# EAGLE design smd (EAGLE 6.4)
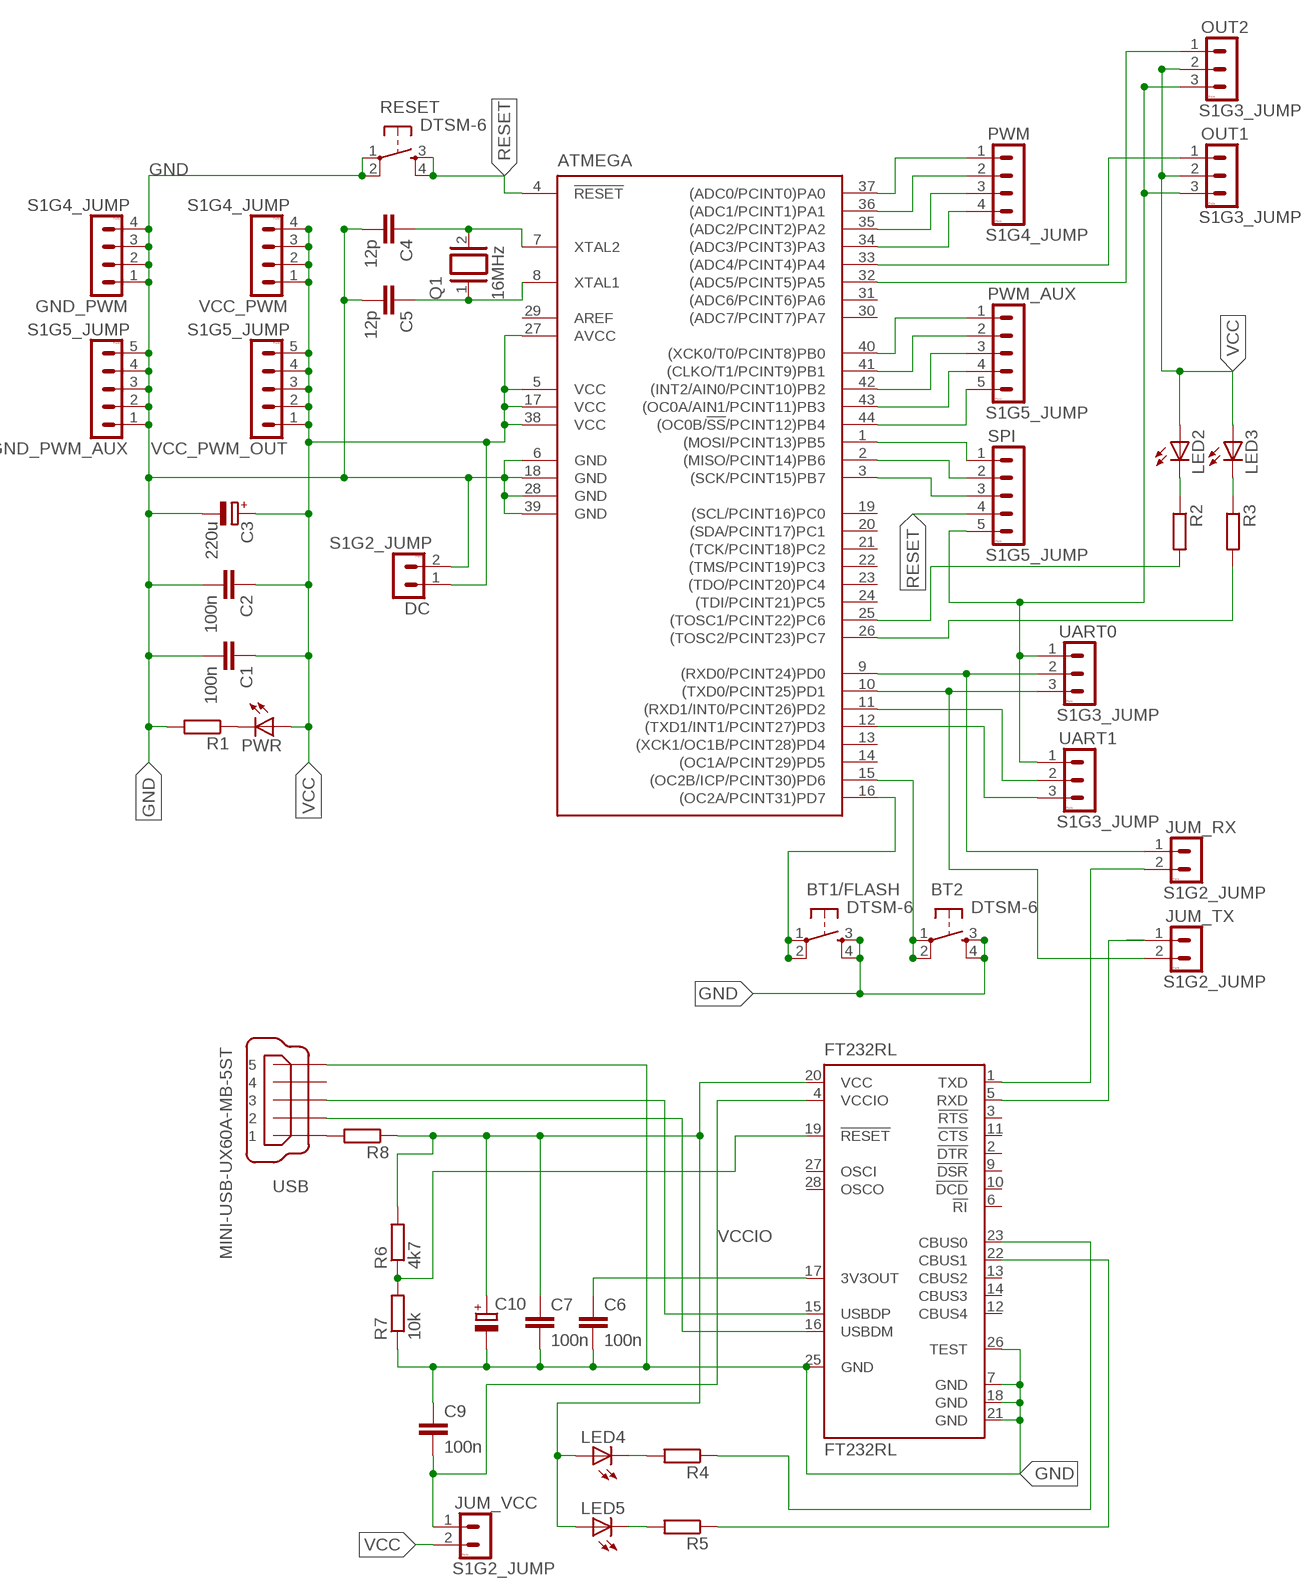
[diagram p0: schematic, sheet 1]

## Parts
ATMEGA  MEGA164P/324P/644P-AU  [TQFP44]
BT1/FLASH  DTSM-6  [DTSM-6]
BT2  DTSM-6  [DTSM-6]
C1  100n  C-EUC0805  [C0805]
C2  100n  C-EUC0805  [C0805]
C3  220u  CPOL-EU150CLZ-0810  [150CLZ-0810]
C4  12p  C-EUC0805  [C0805]
C5  12p  C-EUC0805  [C0805]
C6  100n  C-EUC0805  [C0805]
C7  100n  C-EUC0805  [C0805]
C9  100n  C-EUC0805  [C0805]
C10  CPOL-EUSMCD  [SMC_D]
DC  S1G2_JUMP  [S1G2_JUM]
FT232RL  FT232RL  [SSOP28]
GND_PWM  S1G4_JUMP  [S1G4_JUM]
GND_PWM_AUX  S1G5_JUMP  [S1G5_JUM]
JUM_RX  S1G2_JUMP  [S1G2_JUM]
JUM_TX  S1G2_JUMP  [S1G2_JUM]
JUM_VCC  S1G2_JUMP  [S1G2_JUM]
LED2  LEDSML0805  [SML0805]
LED3  LEDSML0805  [SML0805]
LED4  LEDSML0805  [SML0805]
LED5  LEDSML0805  [SML0805]
OUT1  S1G3_JUMP  [S1G3_JUM]
OUT2  S1G3_JUMP  [S1G3_JUM]
PWM  S1G4_JUMP  [S1G4_JUM]
PWM_AUX  S1G5_JUMP  [S1G5_JUM]
PWR  LEDSML0805  [SML0805]
Q1  16MHz  XTAL/S  [QS]
R1  R-EU_R0805  [R0805]
R2  R-EU_R0805  [R0805]
R3  R-EU_R0805  [R0805]
R4  R-EU_R0805  [R0805]
R5  R-EU_R0805  [R0805]
R6  4k7  R-EU_R0805  [R0805]
R7  10k  R-EU_R0805  [R0805]
R8  R-EU_R0805  [R0805]
RESET  DTSM-6  [DTSM-6]
SPI  S1G5_JUMP  [S1G5_JUM]
UART0  S1G3_JUMP  [S1G3_JUM]
UART1  S1G3_JUMP  [S1G3_JUM]
USB  MINI-USB-UX60A-MB-5ST  [UX60A-MB-5ST]
VCC_PWM  S1G4_JUMP  [S1G4_JUM]
VCC_PWM_OUT  S1G5_JUMP  [S1G5_JUM]

## Nets
ATMEGA_RX0: ATMEGA.9((RXD0/PCINT24)PD0) JUM_RX.1 UART0.2
ATMEGA_RX1: ATMEGA.11((RXD1/INT0/PCINT26)PD2) UART1.2
ATMEGA_TX0: ATMEGA.10((TXD0/PCINT25)PD1) JUM_TX.2 UART0.3
ATMEGA_TX1: ATMEGA.12((TXD1/INT1/PCINT27)PD3) UART1.3
FT_RX: FT232RL.5(RXD) JUM_TX.1
FT_TX: FT232RL.1(TXD) JUM_RX.2
GND: ATMEGA.6(GND) ATMEGA.28(GND) ATMEGA.39(GND) BT1/FLASH.3 BT1/FLASH.4 BT2.3 BT2.4 C1.2 C2.2 C3.- C4.2 C5.2 C6.2 C7.2 C9.1 C10.- DC.2 FT232RL.7(GND) FT232RL.18(GND) FT232RL.21(GND) FT232RL.25(GND) FT232RL.26(TEST) GND_PWM.1 GND_PWM.2 GND_PWM.3 GND_PWM.4 GND_PWM_AUX.1 GND_PWM_AUX.2 GND_PWM_AUX.3 GND_PWM_AUX.4 GND_PWM_AUX.5 OUT1.3 OUT2.3 R1.2 R7.1 RESET.1 RESET.2 SPI.5 UART0.1 UART1.1 USB.5
MISO: ATMEGA.2((MISO/PCINT14)PB6) SPI.2
MOSI: ATMEGA.1((MOSI/PCINT13)PB5) SPI.1
N$1: ATMEGA.37((ADC0/PCINT0)PA0) PWM.1
N$2: ATMEGA.36((ADC1/PCINT1)PA1) PWM.2
N$3: ATMEGA.7(XTAL2) C4.1 Q1.2
N$4: ATMEGA.8(XTAL1) C5.1 Q1.1
N$5: LED2.C R2.1
N$6: ATMEGA.35((ADC2/PCINT2)PA2) PWM.3
N$7: ATMEGA.34((ADC3/PCINT3)PA3) PWM.4
N$8: ATMEGA.40((XCK0/T0/PCINT8)PB0) PWM_AUX.1
N$9: ATMEGA.41((CLKO/T1/PCINT9)PB1) PWM_AUX.2
N$10: ATMEGA.42((INT2/AIN0/PCINT10)PB2) PWM_AUX.3
N$11: ATMEGA.43((OC0A/AIN1/PCINT11)PB3) PWM_AUX.4
N$12: ATMEGA.44((OC0B/!SS!/PCINT12)PB4) PWM_AUX.5
N$13: FT232RL.19(!RESET) R6.1 R7.2
N$14: LED4.C R4.2
N$15: LED5.C R5.2
N$16: FT232RL.23(CBUS0) R4.1
N$17: PWR.C R1.1
N$18: LED3.C R3.1
N$19: ATMEGA.15((OC2B/ICP/PCINT30)PD6) BT2.1 BT2.2
N$20: R8.2 USB.1
N$21: ATMEGA.26((TOSC2/PCINT23)PC7) R3.2
N$22: ATMEGA.25((TOSC1/PCINT22)PC6) R2.2
N$23: FT232RL.22(CBUS1) R5.1
N$24: ATMEGA.33((ADC4/PCINT4)PA4) OUT1.1
N$25: ATMEGA.16((OC2A/PCINT31)PD7) BT1/FLASH.1 BT1/FLASH.2
N$26: ATMEGA.32((ADC5/PCINT5)PA5) OUT2.1
N$27: C6.1 FT232RL.17(3V3OUT)
RESET: ATMEGA.4(!RESET) RESET.3 RESET.4 SPI.4
SCK: ATMEGA.3((SCK/PCINT15)PB7) SPI.3
USBDM: FT232RL.16(USBDM) USB.2
USBDP: FT232RL.15(USBDP) USB.3
VCC: ATMEGA.5(VCC) ATMEGA.17(VCC) ATMEGA.27(AVCC) ATMEGA.38(VCC) C1.1 C2.1 C3.+ DC.1 JUM_VCC.2 LED2.A LED3.A OUT1.2 OUT2.2 PWR.A VCC_PWM.1 VCC_PWM.2 VCC_PWM.3 VCC_PWM.4 VCC_PWM_OUT.1 VCC_PWM_OUT.2 VCC_PWM_OUT.3 VCC_PWM_OUT.4 VCC_PWM_OUT.5
VCC_USB: C7.1 C10.+ FT232RL.20(VCC) LED4.A LED5.A R6.2 R8.1
VCCIO: C9.2 FT232RL.4(VCCIO) JUM_VCC.1
Unconnected: ATMEGA.13((XCK1/OC1B/PCINT28)PD4) ATMEGA.14((OC1A/PCINT29)PD5) ATMEGA.19((SCL/PCINT16)PC0) ATMEGA.20((SDA/PCINT17)PC1) ATMEGA.21((TCK/PCINT18)PC2) ATMEGA.22((TMS/PCINT19)PC3) ATMEGA.23((TDO/PCINT20)PC4) ATMEGA.24((TDI/PCINT21)PC5) ATMEGA.30((ADC7/PCINT7)PA7) ATMEGA.31((ADC6/PCINT6)PA6) FT232RL.2(!DTR) FT232RL.3(!RTS) FT232RL.6(!RI) FT232RL.9(!DSR) FT232RL.10(!DCD) FT232RL.11(!CTS) FT232RL.12(CBUS4) FT232RL.13(CBUS2) FT232RL.14(CBUS3) FT232RL.27(OSCI) FT232RL.28(OSCO) USB.4

## Power pins joined to a net without a drawn wire
AREF: ATMEGA.29(AREF)
GND: ATMEGA.18(GND)

## Library data of the parts
ATMEGA = avr-5:MEGA164P/324P/644P-AU
BT1/FLASH BT2 RESET = switch-tact:DTSM-6
C1 C2 C4-C7 C9 = resistor:C-EU: CAPACITOR, European symbol
C3 C10 = resistor:CPOL-EU: POLARIZED CAPACITOR, European symbol
DC JUM_RX JUM_TX JUM_VCC = #PaJa_konektory:S1G2_JUMP: Radove konektory - koliky - 2x
FT232RL = ftdichip:FT232R: Source: http://www.ftdichip.com/Documents/DataSheets/DS_FT232R_v104.pdf; MPN: FT232RL; OC_FARNELL: 1146032; OC_NEWARK: 91K9918
GND_PWM PWM VCC_PWM = #PaJa_konektory:S1G4_JUMP: Radove konektory - koliky - 4x
GND_PWM_AUX PWM_AUX SPI VCC_PWM_OUT = #PaJa_konektory:S1G5_JUMP: Radove konektory - koliky - 5x
LED2-LED5 PWR = led:LED: LED OSRAM: - CHIPLED LG R971, LG N971, LY N971, LG Q971, LY Q971, LO R971, LY R971 LH N974, LH R974 LS Q976, LO Q976, LY Q976 LO Q996 - Hyper CHIPLED LW Q18S LB Q993, LB Q99A, LB R99A - SideLED LS A670, LO A670, LY A670, LG A670, LP A670 LB A673, LV A673, LT A673, LW A673 LH A674 LY A675 LS A676, LA A676, LO A676, LY A676, LW A676 LS A679, LY A679, LG A679 - Hyper Micro SIDELED® LS Y876, LA Y876, LO Y876, LY Y876 LT Y87S - SmartLED LW L88C, LW L88S LB L89C, LB L89S, LG L890 LS L89K, LO L89K, LY L89K LS L896, LA L896, LO L896, LY L896 - TOPLED LS T670, LO T670, LY T670, LG T670, LP T670 LSG T670, LSP T670, LSY T670, LOP T670, LYG T670 LG T671, LOG T671, LSG T671 LB T673, LV T673, LT T673, LW T673 LH T674 LS T676, LA T676, LO T676, LY T676, LB T676, LH T676, LSB T676, LW T676 LB T67C, LV T67C, LT T67C, LS T67K, LO T67K, LY T67K, LW E67C LS E67B, LA E67B, LO E67B, LY E67B, LB E67C, LV E67C, LT E67C LW T67C LS T679, LY T679, LG T679 LS T770, LO T770, LY T770, LG T770, LP T770 LB T773, LV T773, LT T773, LW T773 LH T774 LS E675, LA E675, LY E675, LS T675 LS T776, LA T776, LO T776, LY T776, LB T776 LHGB T686 LT T68C, LB T68C - Hyper Mini TOPLED® LB M676 - Mini TOPLED Santana® LG M470 LS M47K, LO M47K, LY M47K Source: http://www.osram.convergy.de LUXEON: - LUMILED® LXK2-PW12-R00, LXK2-PW12-S00, LXK2-PW14-U00, LXK2-PW14-V00 LXK2-PM12-R00, LXK2-PM12-S00, LXK2-PM14-U00 LXK2-PE12-Q00, LXK2-PE12-R00, LXK2-PE12-S00, LXK2-PE14-T00, LXK2-PE14-U00 LXK2-PB12-K00, LXK2-PB12-L00, LXK2-PB12-M00, LXK2-PB14-N00, LXK2-PB14-P00, LXK2-PB14-Q00 LXK2-PR12-L00, LXK2-PR12-M00, LXK2-PR14-Q00, LXK2-PR14-R00 LXK2-PD12-Q00, LXK2-PD12-R00, LXK2-PD12-S00 LXK2-PH12-R00, LXK2-PH12-S00 LXK2-PL12-P00, LXK2-PL12-Q00, LXK2-PL12-R00 Source: www.luxeon.com KINGBRIGHT: KA-3528ASYC Source: www.kingbright.com
OUT1 OUT2 UART0 UART1 = #PaJa_konektory:S1G3_JUMP: Radove konektory - koliky - 3x
Q1 = special:XTAL/S: CRYSTAL
R1-R8 = resistor:R-EU_: RESISTOR, European symbol
USB = con-hirose:MINI-USB-: MINI USB Connector Source: http://www.hirose.co.jp/cataloge_hp/e24000019.pdf; OC_FARNELL: unknown; OC_NEWARK: unknown

## Board
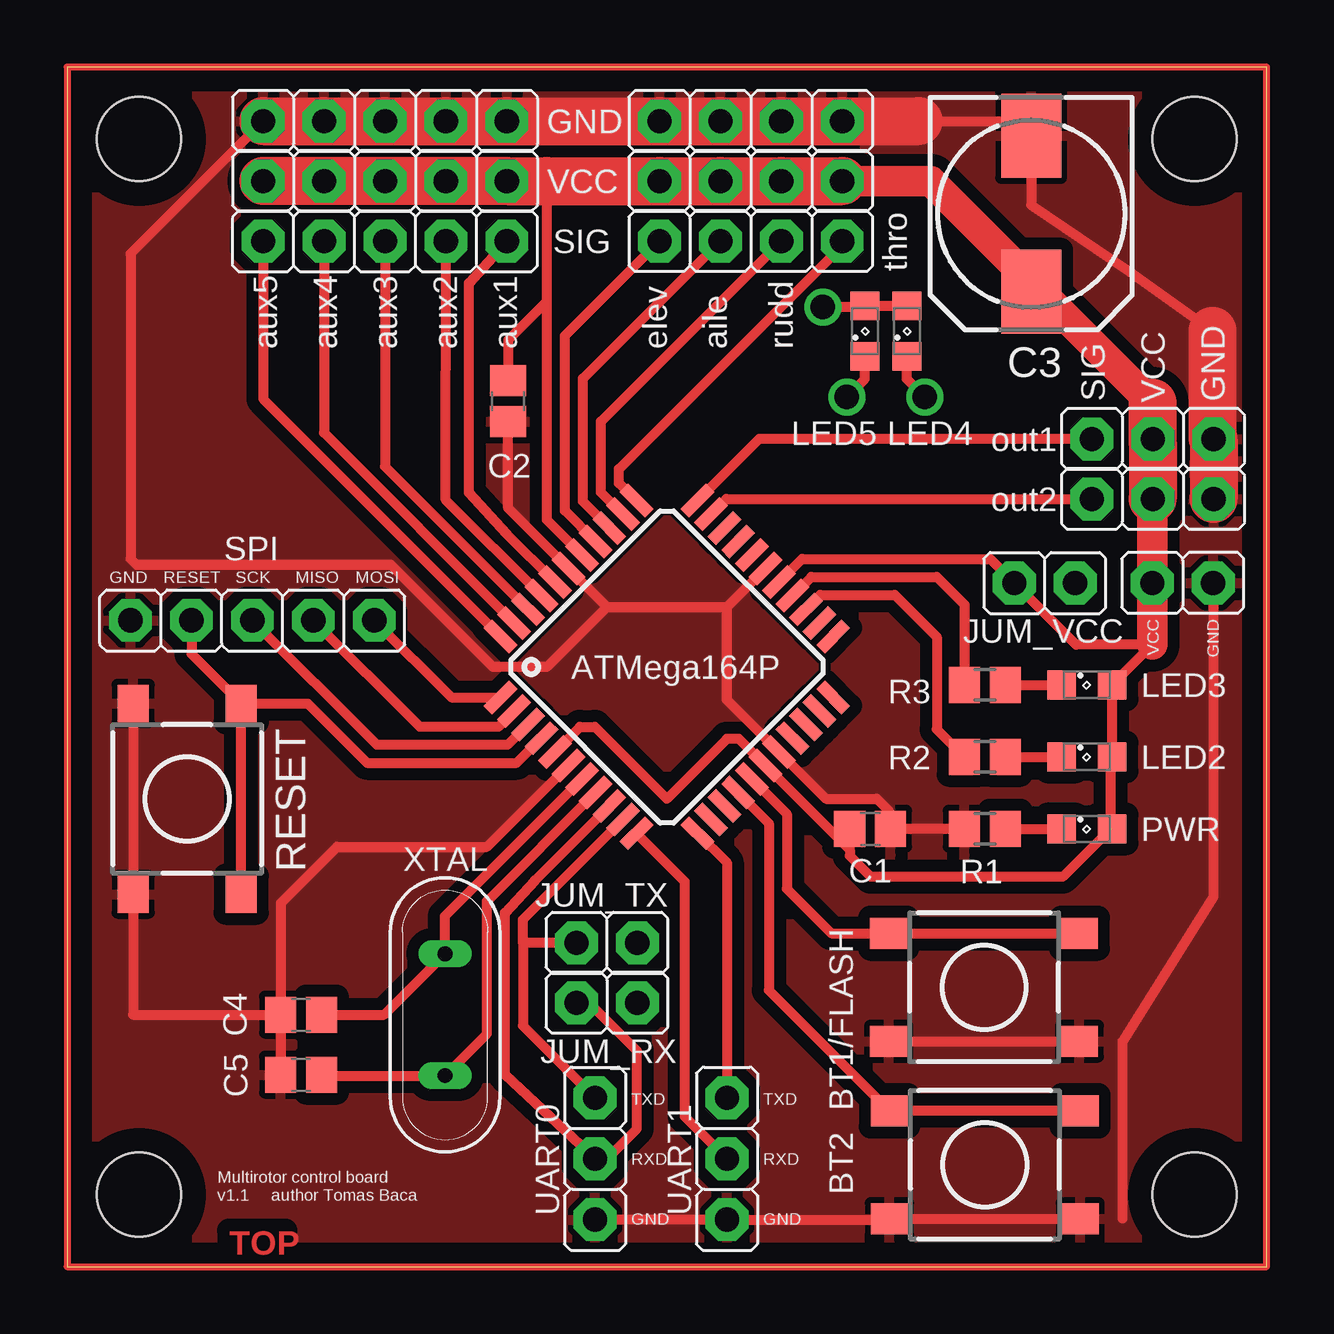
[diagram p1: board, top side]
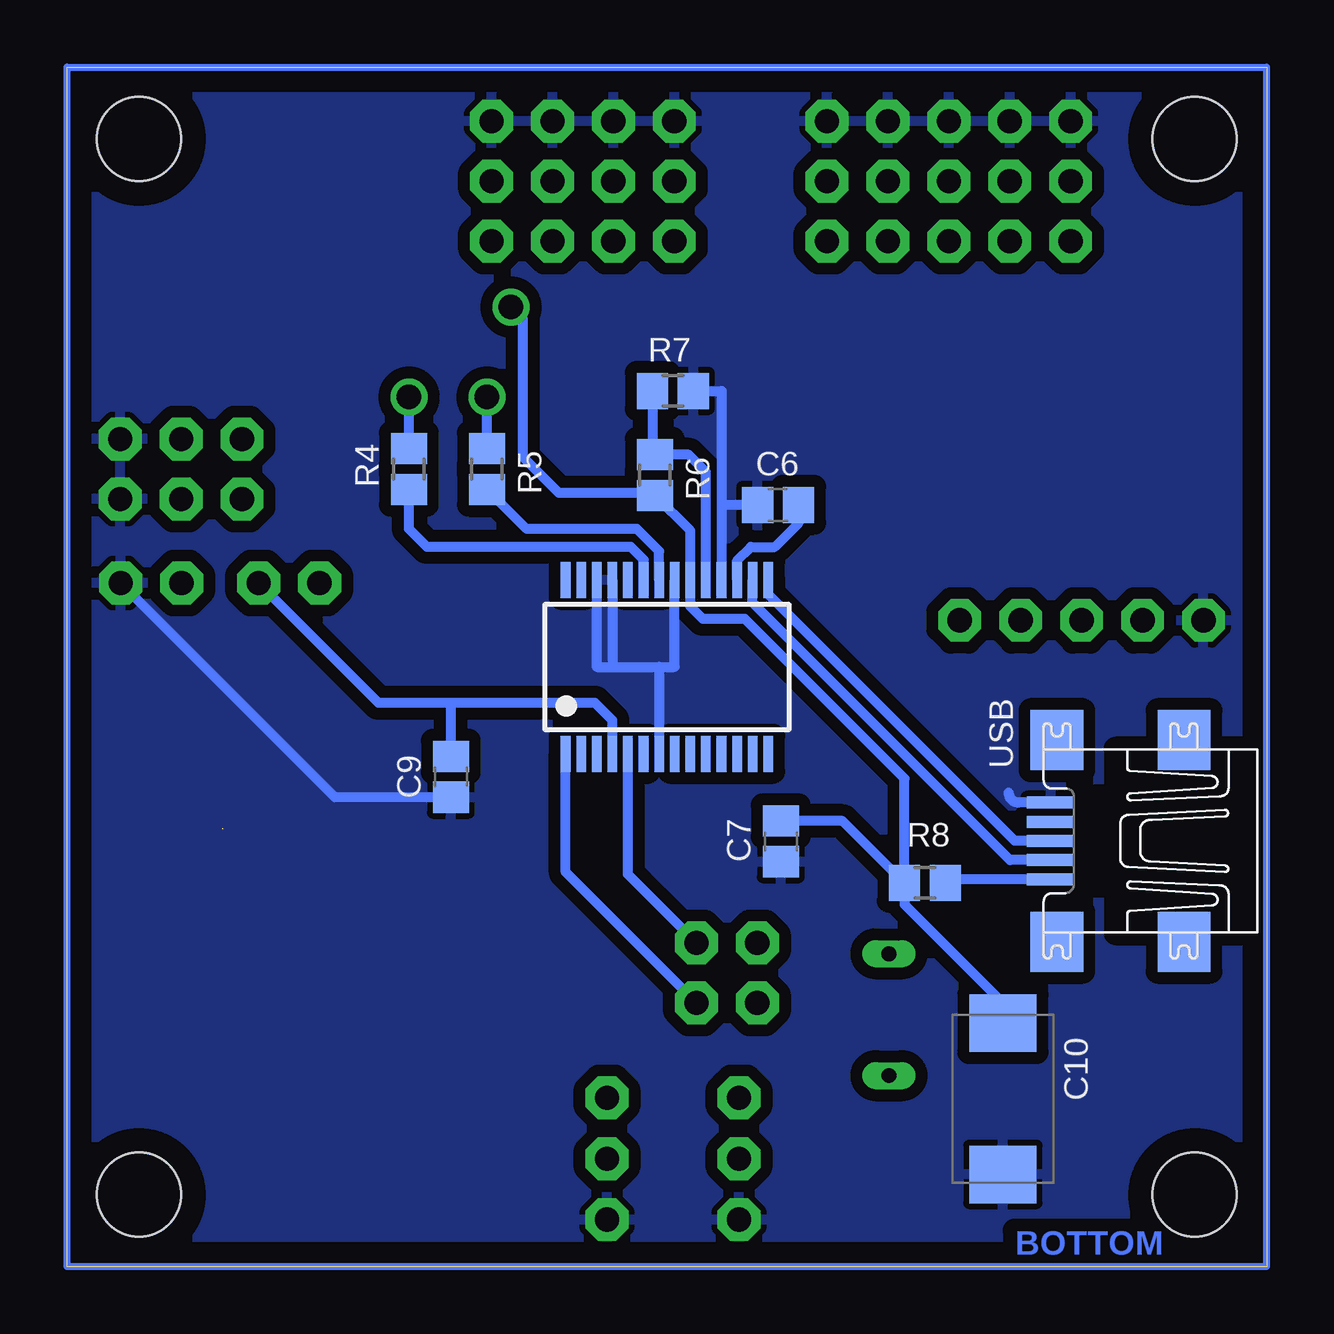
[diagram p2: board, bottom side, seen from below]

Size 50 x 50 mm. Coordinates in mm from the lower left corner, seen from the top.
Outline: 0,0 50,0 50,50 0,50 0,0
Copper layers (1*16): Top 0.035mm / dielectric 1.5mm / Bottom 0.035mm
Design rules "default *": minimum track width 10mil, minimum drill 0.6mm, track to track 0.3mm, track to pad 0.3mm, pad to pad 0.3mm, via to via 0.3mm, smd to smd 0.3mm, copper to edge 40mil, drill to drill 8mil, minimum pad ring 10mil, minimum via ring 8mil, stop-mask expansion 4mil, vias tented up to drill 0mil, thermal gap 10mil
Holes 3.5 mm at 47,47 47,3 3,3 3,47

### Footprints (pad centres in the part's own frame; a part is rotated, then mirrored left to right if it is on the bottom)
TQFP44 = smd 1.5 x 0.5: 1 -5.8,4; 2 -5.8,3.2; 3 -5.8,2.4; 4 -5.8,1.6; 5 -5.8,0.8; 6 -5.8,0; 7 -5.8,-0.8; 8 -5.8,-1.6; 9 -5.8,-2.4; 10 -5.8,-3.2; 11 -5.8,-4; 23 5.8,-4; 24 5.8,-3.2; 25 5.8,-2.4; 26 5.8,-1.6; 27 5.8,-0.8; 28 5.8,0; 29 5.8,0.8; 30 5.8,1.6; 31 5.8,2.4; 32 5.8,3.2; 33 5.8,4 | smd 0.5 x 1.5: 12 -4,-5.8; 13 -3.2,-5.8; 14 -2.4,-5.8; 15 -1.6,-5.8; 16 -0.8,-5.8; 17 0,-5.8; 18 0.8,-5.8; 19 1.6,-5.8; 20 2.4,-5.8; 21 3.2,-5.8; 22 4,-5.8; 34 4,5.8; 35 3.2,5.8; 36 2.4,5.8; 37 1.6,5.8; 38 0.8,5.8; 39 0,5.8; 40 -0.8,5.8; 41 -1.6,5.8; 42 -2.4,5.8; 43 -3.2,5.8; 44 -4,5.8
DTSM-6 = smd 1.55 x 1.3: 1 -3.975,2.25; 2 3.975,2.25; 3 -3.975,-2.25; 4 3.975,-2.25
C0805 = smd 1.3 x 1.5: 1 -0.85,0; 2 0.85,0
150CLZ-0810 = smd 3.5 x 2.5: + 3.25,0; - -3.25,0
SMC_D = smd 2.4 x 2.8: + -3.15,0; - 3.15,0
S1G2_JUM = drill 1.016 pad 1.778 octagon: 1 -1.27,0; 2 1.27,0
SSOP28 = smd 0.4 x 1.5: 1 -4.225,-3.625; 2 -3.575,-3.625; 3 -2.925,-3.625; 4 -2.275,-3.625; 5 -1.625,-3.625; 6 -0.975,-3.625; 7 -0.325,-3.625; 8 0.325,-3.625; 9 0.975,-3.625; 10 1.625,-3.625; 11 2.275,-3.625; 12 2.925,-3.625; 13 3.575,-3.625; 14 4.225,-3.625; 15 4.225,3.625; 16 3.575,3.625; 17 2.925,3.625; 18 2.275,3.625; 19 1.625,3.625; 20 0.975,3.625; 21 0.325,3.625; 22 -0.325,3.625; 23 -0.975,3.625; 24 -1.625,3.625; 25 -2.275,3.625; 26 -2.925,3.625; 27 -3.575,3.625; 28 -4.225,3.625
S1G4_JUM = drill 1.016 pad 1.778 octagon: 1 -3.81,0; 2 -1.27,0; 3 1.27,0; 4 3.81,0
S1G5_JUM = drill 1.016 pad 1.778 octagon: 1 -5.08,0; 2 -2.54,0; 3 0,0; 4 2.54,0; 5 5.08,0
SML0805 = smd 1.2 x 1.2: A 1.05,0; C -1.05,0
S1G3_JUM = drill 1.016 pad 1.778 octagon: 1 -2.54,0; 2 0,0; 3 2.54,0
QS = drill 0.61 long: 1 -2.54,0; 2 2.54,0
R0805 = smd 1.3 x 1.5: 1 -0.85,0; 2 0.85,0
UX60A-MB-5ST = smd 2 x 0.5: 1 2.25,1.6; 2 2.25,0.8; 3 2.25,0; 4 2.25,-0.8; 5 2.25,-1.6 | smd 2.2 x 2.5: M1 -3.3,-4.2; M2 -3.3,4.2; M3 2,4.2; M4 2,-4.2

### Placement (x,y rotation side)
ATMEGA  25,25 45 top
BT1/FLASH  38.22,11.65 0 top
BT2  38.25,4.25 0 top
C1  33.47,18.25 0 top
C2  18.38,36.08 270 top
C3  40.18,43.89 270 top
C4  9.75,10.5 180 top
C5  9.75,8 180 top
C6  20.37,31.75 180 bottom
C7  20.25,17.73 270 bottom
C9  34,20.42 90 bottom
C10  11,7 270 bottom
DC  46.5,28.5 0 top
FT232RL  25,25 0 bottom
GND_PWM  28.5,47.75 0 top
GND_PWM_AUX  13.25,47.75 0 top
JUM_RX  22.5,11 0 top
JUM_TX  22.5,13.5 180 top
JUM_VCC  40.75,28.5 180 top
LED2  42.5,21.25 0 top
LED3  42.5,24.25 0 top
LED4  35,39 90 top
LED5  33.25,39 90 top
OUT1  45.25,34.5 0 top
OUT2  45.25,32 0 top
PWM  28.5,42.75 0 top
PWM_AUX  13.25,42.75 180 top
PWR  42.5,18.25 0 top
Q1  15.75,10.5 90 top
R1  38.25,18.25 180 top
R2  38.25,21.25 180 top
R3  38.25,24.25 180 top
R4  35.75,33.25 90 bottom
R5  32.5,33.25 90 bottom
R6  25.5,33 270 bottom
R7  24.75,36.5 180 bottom
R8  14.25,16 0 bottom
RESET  5,19.5 90 top
SPI  7.72,26.94 180 top
UART0  22,4.5 90 top
UART1  27.5,4.5 90 top
USB  6.75,17.75 180 bottom
VCC_PWM  28.5,45.25 0 top
VCC_PWM_OUT  13.25,45.25 0 top

### Tracks (layer width: path | path; a pad name or v marks a point on that pad's centre or on a via)
ATMEGA_RX0
  Top 0.406: ATMEGA.9 19.5,16.11 18.25,14.75 18.25,8 UART0.2 22.5,4.5 23.75,5.75 23.75,9 21.75,11 JUM_RX.1
ATMEGA_RX1
  Top 0.406: ATMEGA.11 25.75,16.05 25.75,6.25 UART1.2
ATMEGA_TX0
  Top 0.406: 19,13.5 19,14.47 ATMEGA.10 | JUM_TX.2 19,13.5 | 19,13.5 19,10.04 UART0.3
ATMEGA_TX1
  Top 0.406: ATMEGA.12 27.5,16.84 UART1.3
FT_RX
  Bottom 0.406: JUM_TX.1 26.62,16.36 FT232RL.5
FT_TX
  Bottom 0.406: JUM_RX.2 29.23,16.45 FT232RL.1
GND
  Top 0.406: R1.2 C1.2 34.25,18.32 34.25,19 33.75,19.5 31.63,19.5 ATMEGA.18 27.5,23.63 27.5,27.5 | 2.64,23.59 RESET.2 RESET.1 2.75,10.5 C4.2 | C4.2 C5.2 | 44,2 44,9.4 47.79,15.44 47.79,28.5 DC.2 | C4.2 8.9,15.15 11.25,17.5 17.5,17.5 ATMEGA.6 | C2.2 18.38,31.62 ATMEGA.39 22.5,27.5 | 27.5,27.5 ATMEGA.28 | 22.5,27.5 27.5,27.5 | GND_PWM_AUX.1 2.64,42.22 2.64,29.5 2.89,29.25 13.5,29.25 17.75,25 20,25 22.5,27.5 | 47.75,38 47.75,39 44.25,41.5 40.18,44.25 C3.- 39.57,47.75 35.5,47.75 | UART0.1 UART1.1 34.27,1.96 | BT1/FLASH.3 BT1/FLASH.4 | BT2.3 BT2.4
  Top 2: GND_PWM_AUX.1 GND_PWM_AUX.2 GND_PWM_AUX.3 GND_PWM_AUX.4 GND_PWM_AUX.5 GND_PWM.1 GND_PWM.2 GND_PWM.3 GND_PWM.4 35.5,47.75 | 47.75,34.54 47.75,39 | OUT1.3 OUT2.3
  Bottom 0.406: C6.2 22.73,31.75 | 22.73,31.75 FT232RL.18 | 25.32,25 24.68,25 FT232RL.21 | FT232RL.25 27.27,25 | 27.27,25 25.32,25 | FT232RL.26 27.93,25 27.27,25 | 25.32,25 FT232RL.7 | USB.5 10.35,19.35 arc90 10.75,19.75 | R7.1 22.73,36.5 22.73,31.75 | C9.1 38.84,19.57 DC.2
  pour Bottom (isolate 0.5): -0.75,51 51,51 51,-1 -0.75,-1
  pour Top (isolate 0.5): -0.5,50.75 51,50.75 51,-0.5 -0.5,-0.5
MISO
  Top 0.406: ATMEGA.2 17.98,22.5 15,22.5 14.7,22.5 SPI.2
MOSI
  Top 0.406: SPI.1 16.01,23.73 ATMEGA.1
N$1
  Top 0.406: ATMEGA.37 20.75,31.51 20.75,38.81 PWM.1
N$2
  Top 0.406: ATMEGA.36 21.5,31.89 21.5,37.02 PWM.2
N$3
  Top 0.406: C4.1 13.21,10.5 Q1.2 15.75,14.62 ATMEGA.7
N$4
  Top 0.406: C5.1 10.6,7.96 Q1.1 17.5,9.71 17.5,15.24 ATMEGA.8
N$5
  Top 0.406: R2.1 LED2.C
N$6
  Top 0.406: ATMEGA.35 22.25,32.27 22.25,35.23 PWM.3
N$7
  Top 0.406: ATMEGA.34 23,32.66 23,33.25 32.31,42.56 PWM.4
N$8
  Top 0.406: ATMEGA.40 18.32,30.55 16.75,32.25 16.75,41 PWM_AUX.1
N$9
  Top 0.406: ATMEGA.41 15.78,31.96 PWM_AUX.2
N$10
  Top 0.406: PWM_AUX.3 13.25,33.36 ATMEGA.42
N$11
  Top 0.406: PWM_AUX.4 10.71,34.77 ATMEGA.43
N$12
  Top 0.406: PWM_AUX.5 8.17,36.17 ATMEGA.44
N$13
  Bottom 0.406: R7.2 25.6,33.85 R6.1 24.1,33.85 23.38,33.12 FT232RL.19
N$14  (via drill 1.02)
  Top 0.406: v35.75,36.25 35,37 LED4.C
  Bottom 0.406: R4.2 v35.75,36.25
N$15  (via drill 1.02)
  Top 0.406: v32.5,36.25 33.25,37 LED5.C
  Bottom 0.406: R5.2 v32.5,36.25
N$16
  Bottom 0.406: R4.1 35.75,30.75 35,30 26.5,30 25.98,29.48 FT232RL.23
N$17
  Top 0.406: PWR.C 41.25,18.25 39.25,18.25 R1.1
N$18
  Top 0.406: R3.1 LED3.C
N$19
  Top 0.406: ATMEGA.15 29.25,18.49 29.25,11.53 BT2.1 BT2.2
N$20
  Bottom 0.406: USB.1 13.4,16.15 R8.2
N$21
  Top 0.406: ATMEGA.26 31.01,28.75 36.25,28.75 37.4,27.6 R3.2
N$22
  Top 0.406: ATMEGA.25 31.39,28 34.5,28 36.25,26.25 36.25,22.4 R2.2
N$23
  Bottom 0.406: R5.1 30.85,30.75 26.25,30.75 25.32,29.82 FT232RL.22
N$24
  Top 0.406: OUT1.1 28.84,34.5 ATMEGA.33
N$25
  Top 0.406: BT1/FLASH.2 BT1/FLASH.1 31.85,13.9 30,15.75 30,18.87 ATMEGA.16
N$26
  Top 0.406: ATMEGA.32 27.48,32 OUT2.1
N$27
  Bottom 0.406: C6.1 19.52,30.98 20.5,30 21.5,30 22.07,29.43 FT232RL.17
N$28
  Top 0.3: 0,0 50,0 50,50 0,50 0,0
N$29
  Bottom 0.3: 0,0 50,0 50,50 0,50 0,0
RESET
  Top 0.406: SPI.4 5.18,25.55 RESET.4 | RESET.3 RESET.4 | ATMEGA.4 18.74,21 12.5,21 10.03,23.48 RESET.4
SCK
  Top 0.406: ATMEGA.3 18.36,21.75 14.5,21.75 12.91,21.75 SPI.3
USBDM
  Bottom 0.406: USB.2 10.7,16.95 20.75,27 21.43,27.68 FT232RL.16
USBDP
  Bottom 0.406: USB.3 10.5,17.75 16.25,23.5 20.77,28.02 FT232RL.15
VCC  (1 unrouted)
  Top 0.406: ATMEGA.17 32.62,17.38 | ATMEGA.17 30.75,19.25 | OUT1.2 45.25,34.37 | ATMEGA.17 28,22 27.5,22 25,19.5 22,22.5 21.37,22.5 ATMEGA.5 | 45.23,31.98 OUT2.2 | 20,40.25 20,31.13 ATMEGA.38 | 20,40.25 18.38,38.63 C2.1 | 20,40.25 20,45.25 | ATMEGA.27 30.63,29.5 38.48,29.5 JUM_VCC.2 42.05,25.93 45.23,25.93 LED3.A LED2.A 43.5,21.25 43.5,18.25 41.5,16.25 33.5,16.25 32.62,17.13 32.62,17.38 | 32.62,17.38 C1.1
  Top 1.27: VCC_PWM.4 36,45.25 40.18,41.07 C3.+ 40.38,40.84 45.21,36 45.25,36 | 45.23,31.98 DC.1 45.23,25.93
  Top 2: 45.25,34.37 OUT2.2 | OUT1.2 45.25,36 | 40.38,40.84 40.38,40.88 | VCC_PWM_OUT.1 VCC_PWM_OUT.2 VCC_PWM_OUT.3 VCC_PWM_OUT.4 VCC_PWM_OUT.5 20,45.25 VCC_PWM.1 VCC_PWM.2 VCC_PWM.3 VCC_PWM.4
VCC_USB  (via drill 1.02)
  Top 0.406: LED4.A LED5.A 33.2,40 v31.5,40
  Bottom 0.406: R8.1 15.1,20.35 21.75,27 23.5,27 24.02,27.52 FT232RL.20 24.02,30.68 R6.2 25.6,32.25 29.5,32.25 31,33.75 31,39.5 v31.5,40 | R8.1 17.68,18.58 C7.1 | R8.1 15.1,15.1 11,11 C10.+
VCCIO
  Bottom 0.406: C9.2 34,23.5 | 34,23.5 37.02,23.5 JUM_VCC.1 | FT232RL.4 27.27,22.77 28,23.5 34,23.5

### Text on the board
Top: TOP
Bottom: BOTTOM
tNames: GND | VCC | SIG | thro | VCC | GND | aux5 | aux4 | aux3 | aux2 | aux1 | elev | aile | rudd | SIG | out1 | out2 | GND | RESET | SCK | MISO | MOSI | VCC | GND | ATMega164P | XTAL | TXD | TXD | Multirotor control board | RXD | RXD | v1.1 | author Tomas Baca | GND | GND